# EAGLE schematic Obsidian (EAGLE 8.2.2)
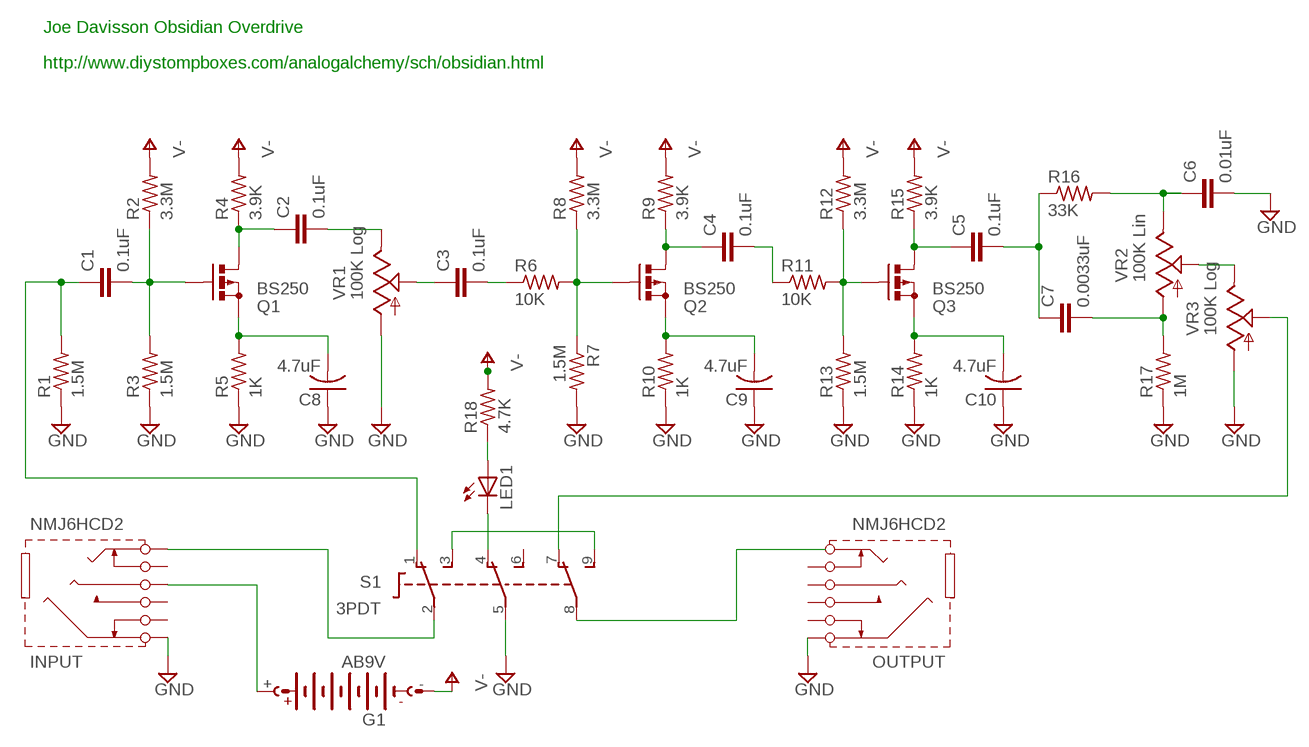
[diagram p0: schematic, sheet 1]

## Parts
C1  0.1uF  C5/4.5  [C5B4.5]
C2  0.1uF  C5/4.5  [C5B4.5]
C3  0.1uF  C5/4.5  [C5B4.5]
C4  0.1uF  C5/4.5  [C5B4.5]
C5  0.1uF  C5/4.5  [C5B4.5]
C6  0.01uF  C5/4.5  [C5B4.5]
C7  0.0033uF  C5/4.5  [C5B4.5]
C8  4.7uF  C-US025-025X050  [C025-025X050]
C9  4.7uF  C-US025-025X050  [C025-025X050]
C10  4.7uF  C-US025-025X050  [C025-025X050]
G1  AB9V  [AB9V]
INPUT  NMJ6HCD2  [NMJ6HCD2]
LED1  LED5MM  [LED5MM]
OUTPUT  NMJ6HCD2  [NMJ6HCD2]
Q1  BS250  [SOT54E]
Q2  BS250  [SOT54E]
Q3  BS250  [SOT54E]
R1  1.5M  R-US_0207/7  [0207/7]
R2  3.3M  R-US_0204/7  [0204/7]
R3  1.5M  R-US_0207/7  [0207/7]
R4  3.9K  R-US_0207/7  [0207/7]
R5  1K  R-US_0207/7  [0207/7]
R6  10K  R-US_0207/7  [0207/7]
R7  1.5M  R-US_0207/7  [0207/7]
R8  3.3M  R-US_0207/7  [0207/7]
R9  3.9K  R-US_0204/7  [0204/7]
R10  1K  R-US_0204/7  [0204/7]
R11  10K  R-US_0204/7  [0204/7]
R12  3.3M  R-US_0204/7  [0204/7]
R13  1.5M  R-US_0207/7  [0207/7]
R14  1K  R-US_0204/7  [0204/7]
R15  3.9K  R-US_0204/7  [0204/7]
R16  33K  R-US_0204/7  [0204/7]
R17  1M  R-US_0204/7  [0204/7]
R18  4.7K  R-US_0204/7  [0204/7]
S1  3PDT  [3PDT]
VR1  100K Log  9MM_SNAP-IN_POT_  [9MM_SNAP-IN_POT]
VR2  100K Lin  9MM_SNAP-IN_POT_  [9MM_SNAP-IN_POT]
VR3  100K Log  9MM_SNAP-IN_POT_  [9MM_SNAP-IN_POT]

## Nets
GND: C6.2 C8.1 C9.1 C10.1 INPUT.S(SLEEVE) OUTPUT.S(SLEEVE) R1.1 R3.1 R5.1 R7.2 R10.1 R14.1 R17.1 S1.5(P2) VR1.1(A)
N$1: C2.1 Q1.D R4.1
N$2: C8.2 Q1.S R5.2
N$3: C1.2 Q1.G R2.1 R3.2
N$4: Q2.G R6.2 R7.1 R8.1
N$5: C1.1 R1.2 S1.1(O1)
N$6: C3.2 R6.1
N$7: C9.2 Q2.S R10.2
N$8: C5.1 Q3.D R15.1
N$9: C4.1 Q2.D R9.1
N$10: C10.2 Q3.S R14.2
N$11: Q3.G R11.2 R12.1 R13.2
N$12: C4.2 R11.1
N$13: C2.2 VR1.3(E)
N$14: C6.1 R16.2 VR2.3(E)
N$15: C3.1 VR1.2(S)
N$16: C5.2 C7.1 R16.1
N$17: C7.2 R17.2 VR2.1(A)
N$18: VR2.2(S) VR3.3(E)
N$19: S1.7(O3) VR3.2(S)
N$20: G1.+ INPUT.R(RING)
N$21: LED1.K(C) S1.4(O2)
N$22: INPUT.T(TIP) S1.2(P1)
N$23: OUTPUT.T(TIP)
N$24: S1.3(S1) S1.9(S3)
N$25: S1.8(P3)
N$27: LED1.A R18.1
V-: G1.- R2.2 R4.2 R8.2 R9.2 R12.2 R15.2
Unconnected: INPUT.RN(RING-S) INPUT.SN(SLEEVE-S) INPUT.TN(TIP-S) OUTPUT.R(RING) OUTPUT.RN(RING-S) OUTPUT.SN(SLEEVE-S) OUTPUT.TN(TIP-S) R13.1 R18.2 S1.6(S2) VR3.1(A)

## Notes on the sheet
- Joe Davisson Obsidian Overdrive
- http://www.diystompboxes.com/analogalchemy/sch/obsidian.html

## Library data of the parts
C1-C7 = capacitor-wima:C: CAPACITOR naming: grid - package width
C8-C10 = rcl:C-US: CAPACITOR, American symbol
G1 = battery:AB9V: 9-V BATTERY CLIP
INPUT OUTPUT = audio:NMJ6HCD2: M-Series 1/4" Mono Phone Connector
LED1 = led:LED: LED OSRAM: - CHIPLED LG R971, LG N971, LY N971, LG Q971, LY Q971, LO R971, LY R971 LH N974, LH R974 LS Q976, LO Q976, LY Q976 LO Q996 - Hyper CHIPLED LW Q18S LB Q993, LB Q99A, LB R99A - SideLED LS A670, LO A670, LY A670, LG A670, LP A670 LB A673, LV A673, LT A673, LW A673 LH A674 LY A675 LS A676, LA A676, LO A676, LY A676, LW A676 LS A679, LY A679, LG A679 - Hyper Micro SIDELED® LS Y876, LA Y876, LO Y876, LY Y876 LT Y87S - SmartLED LW L88C, LW L88S LB L89C, LB L89S, LG L890 LS L89K, LO L89K, LY L89K LS L896, LA L896, LO L896, LY L896 - TOPLED LS T670, LO T670, LY T670, LG T670, LP T670 LSG T670, LSP T670, LSY T670, LOP T670, LYG T670 LG T671, LOG T671, LSG T671 LB T673, LV T673, LT T673, LW T673 LH T674 LS T676, LA T676, LO T676, LY T676, LB T676, LH T676, LSB T676, LW T676 LB T67C, LV T67C, LT T67C, LS T67K, LO T67K, LY T67K, LW E67C LS E67B, LA E67B, LO E67B, LY E67B, LB E67C, LV E67C, LT E67C LW T67C LS T679, LY T679, LG T679 LS T770, LO T770, LY T770, LG T770, LP T770 LB T773, LV T773, LT T773, LW T773 LH T774 LS E675, LA E675, LY E675, LS T675 LS T776, LA T776, LO T776, LY T776, LB T776 LHGB T686 LT T68C, LB T68C - Hyper Mini TOPLED® LB M676 - Mini TOPLED Santana® LG M470 LS M47K, LO M47K, LY M47K Source: http://www.osram.convergy.de LUXEON: - LUMILED® LXK2-PW12-R00, LXK2-PW12-S00, LXK2-PW14-U00, LXK2-PW14-V00 LXK2-PM12-R00, LXK2-PM12-S00, LXK2-PM14-U00 LXK2-PE12-Q00, LXK2-PE12-R00, LXK2-PE12-S00, LXK2-PE14-T00, LXK2-PE14-U00 LXK2-PB12-K00, LXK2-PB12-L00, LXK2-PB12-M00, LXK2-PB14-N00, LXK2-PB14-P00, LXK2-PB14-Q00 LXK2-PR12-L00, LXK2-PR12-M00, LXK2-PR14-Q00, LXK2-PR14-R00 LXK2-PD12-Q00, LXK2-PD12-R00, LXK2-PD12-S00 LXK2-PH12-R00, LXK2-PH12-S00 LXK2-PL12-P00, LXK2-PL12-Q00, LXK2-PL12-R00 Source: www.luxeon.com KINGBRIGHT: KA-3528ASYC Source: www.kingbright.com
Q1-Q3 = transistor-small-signal:BS250: P-CHANNEL MOS FET
R1 R3-R8 R13 = resistor:R-US_: RESISTOR, American symbol
R2 R9-R12 R14-R18 = rcl:R-US_: RESISTOR, American symbol
S1 = switch:3PDT: 3PDT 9 pin footswitch SF17020F-0302-21R-L Source: 3PDT.jpg
VR1-VR3 = MusicThingModular:9MM_SNAP-IN_POT: 9mm vertical snap-in pot, Alpha / Panasonic style